# Altium schematic sheet Sheet2.SchDoc
size A3; Organization: Altium Limited; Address1: L3, 12a Rodborough Rd; Address2: Frenchs Forest; Address3: NSW; Address4: Australia 2086
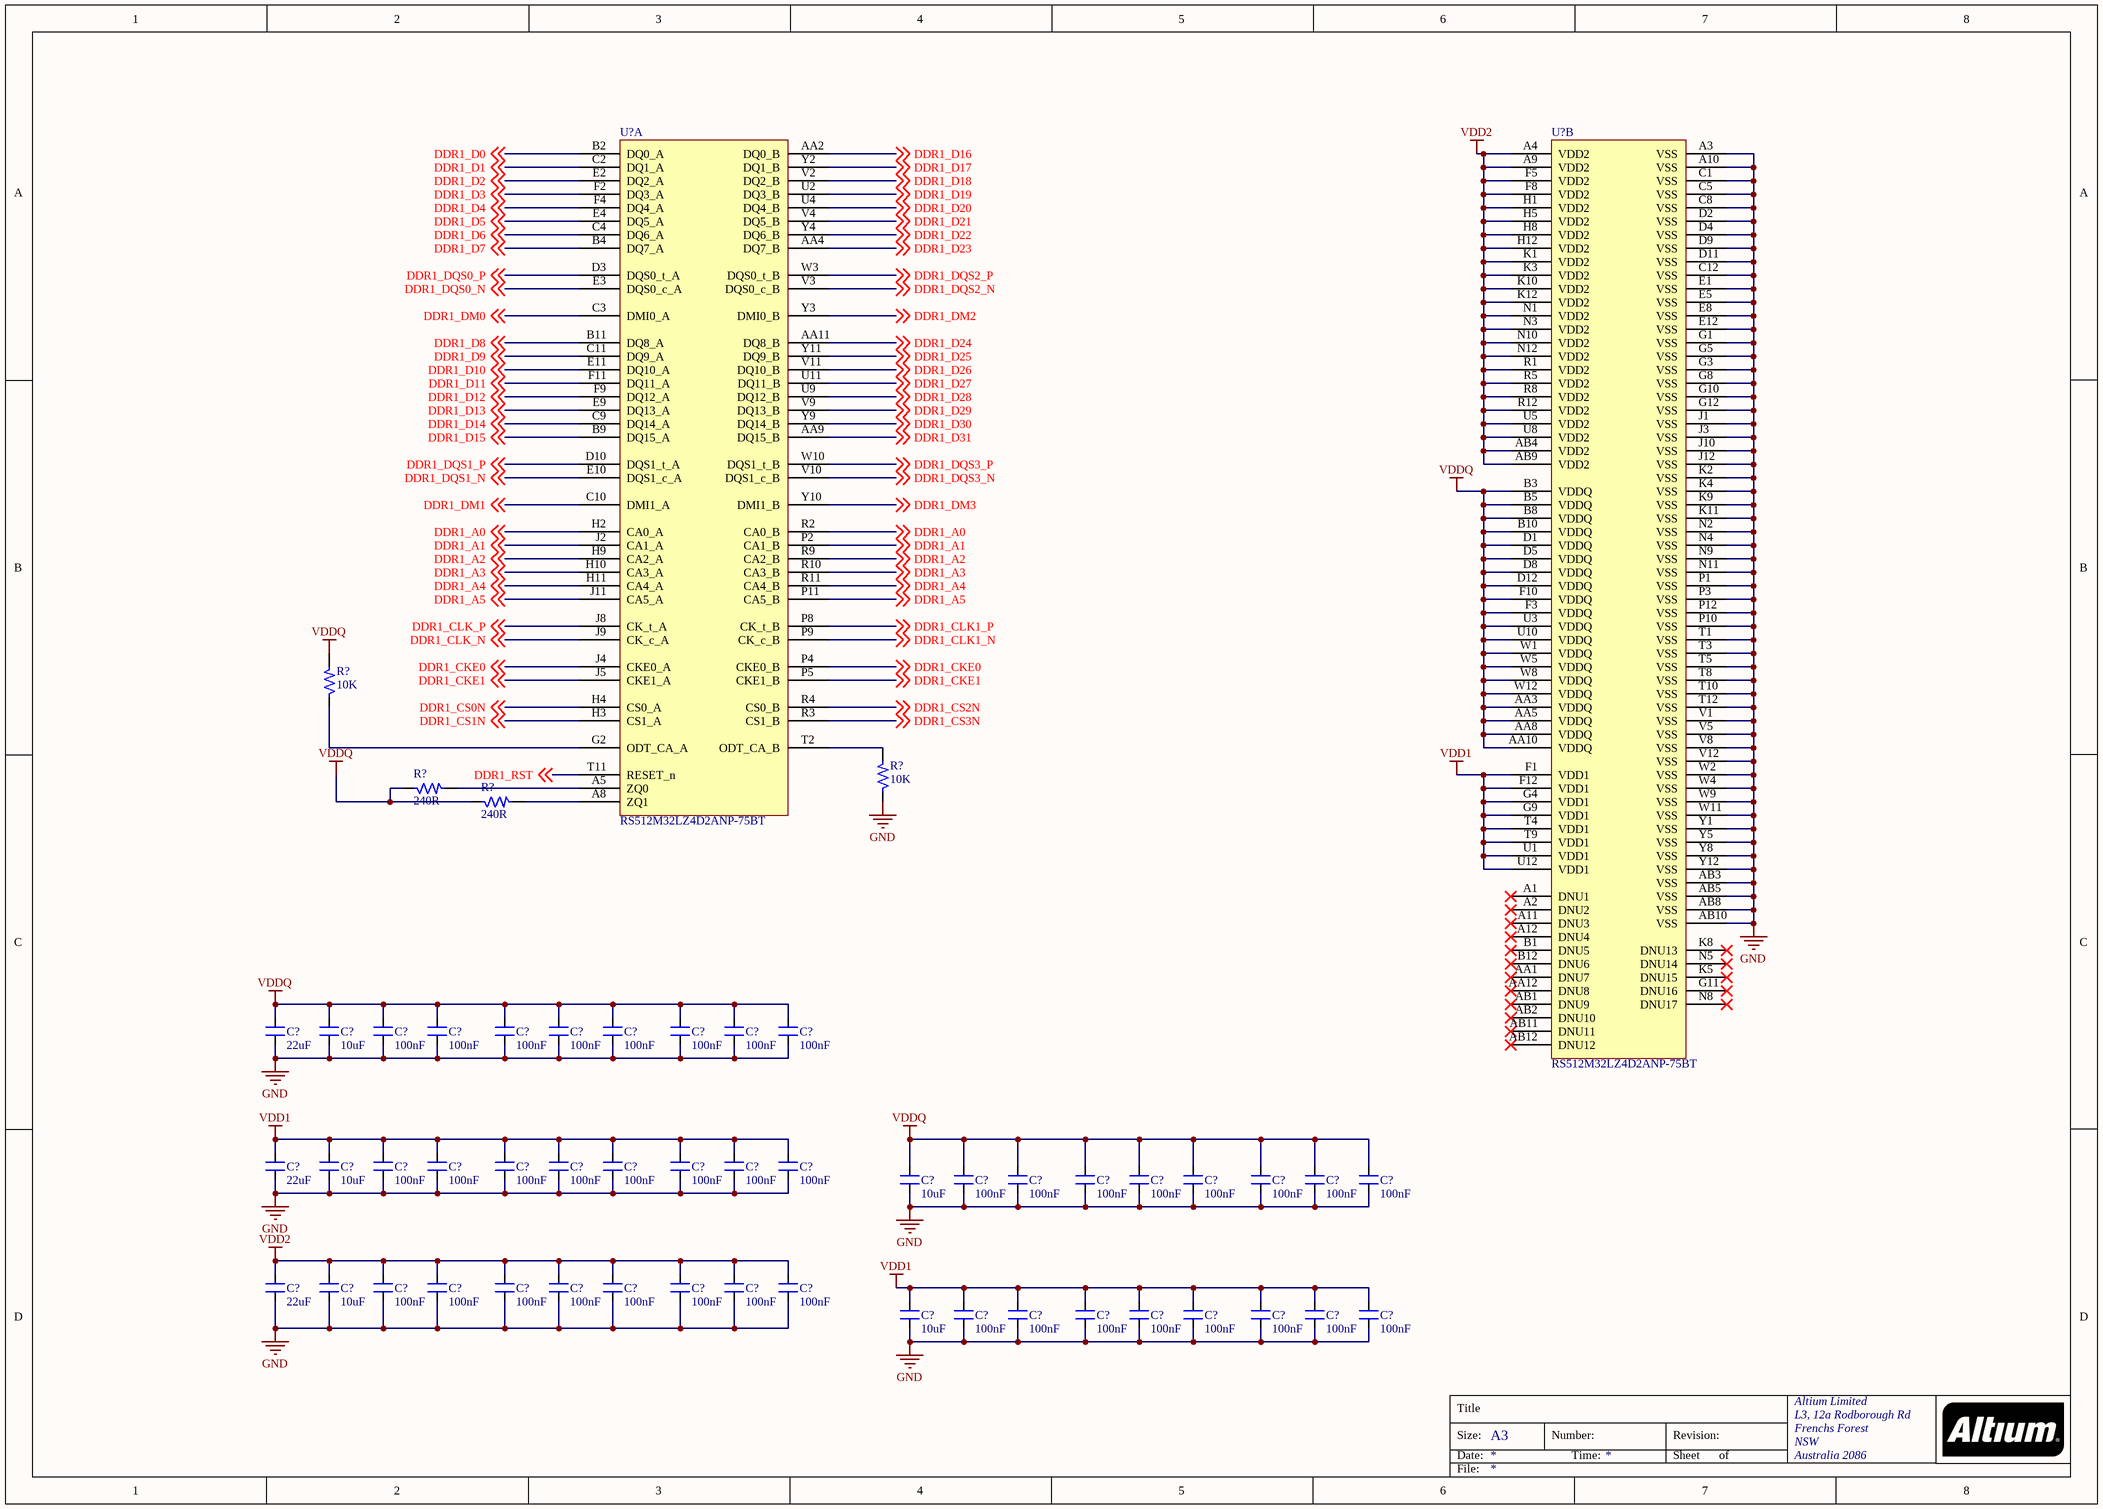
[diagram p0: Sheet2.SchDoc]

## Parts
(Parts that share a designator on the sheet are numbered #1, #2 ... from top to bottom, then left to right.)
C?#1  22uF  [CAP_0603]
C?#2  10uF  [CAP_0603]
C?#3  100nF  [CAP_0201]
C?#4  100nF  [CAP_0201]
C?#5  100nF  [CAP_0201]
C?#6  100nF  [CAP_0201]
C?#7  100nF  [CAP_0201]
C?#8  100nF  [CAP_0201]
C?#9  100nF  [CAP_0201]
C?#10  100nF  [CAP_0201]
C?#11  22uF  [CAP_0603]
C?#12  10uF  [CAP_0603]
C?#13  100nF  [CAP_0201]
C?#14  100nF  [CAP_0201]
C?#15  100nF  [CAP_0201]
C?#16  100nF  [CAP_0201]
C?#17  100nF  [CAP_0201]
C?#18  100nF  [CAP_0201]
C?#19  100nF  [CAP_0201]
C?#20  100nF  [CAP_0201]
C?#21  10uF  [CAP_0603]
C?#22  100nF  [CAP_0201]
C?#23  100nF  [CAP_0201]
C?#24  100nF  [CAP_0201]
C?#25  100nF  [CAP_0201]
C?#26  100nF  [CAP_0201]
C?#27  100nF  [CAP_0201]
C?#28  100nF  [CAP_0201]
C?#29  100nF  [CAP_0201]
C?#30  22uF  [CAP_0603]
C?#31  10uF  [CAP_0603]
C?#32  100nF  [CAP_0201]
C?#33  100nF  [CAP_0201]
C?#34  100nF  [CAP_0201]
C?#35  100nF  [CAP_0201]
C?#36  100nF  [CAP_0201]
C?#37  100nF  [CAP_0201]
C?#38  100nF  [CAP_0201]
C?#39  100nF  [CAP_0201]
C?#40  10uF  [CAP_0603]
C?#41  100nF  [CAP_0201]
C?#42  100nF  [CAP_0201]
C?#43  100nF  [CAP_0201]
C?#44  100nF  [CAP_0201]
C?#45  100nF  [CAP_0201]
C?#46  100nF  [CAP_0201]
C?#47  100nF  [CAP_0201]
C?#48  100nF  [CAP_0201]
R?#1  10K  [RES_0201]
R?#2  240R  [RES_0201]
R?#3  240R  [RES_0201]
R?#4  10K  [RES_0201]
U?#1  RS512M32LZ4D2ANP-75BT  [FBGA200_SMD]  (part A of 2)
U?#2  RS512M32LZ4D2ANP-75BT  [FBGA200_SMD]  (part B of 2)

## Nets
GND: C?#1.1 C?#2.1 C?#3.1 C?#4.1 C?#5.1 C?#6.1 C?#7.1 C?#8.1 C?#9.1 C?#10.1 C?#11.1 C?#12.1 C?#13.1 C?#14.1 C?#15.1 C?#16.1 C?#17.1 C?#18.1 C?#19.1 C?#20.1 C?#21.1 C?#22.1 C?#23.1 C?#24.1 C?#25.1 C?#26.1 C?#27.1 C?#28.1 C?#29.1 C?#30.1 C?#31.1 C?#32.1 C?#33.1 C?#34.1 C?#35.1 C?#36.1 C?#37.1 C?#38.1 C?#39.1 C?#40.1 C?#41.1 C?#42.1 C?#43.1 C?#44.1 C?#45.1 C?#46.1 C?#47.1 C?#48.1 R?#4.1 U?#2.A3(VSS) U?#2.A10(VSS) U?#2.AB3(VSS) U?#2.AB5(VSS) U?#2.AB8(VSS) U?#2.AB10(VSS) U?#2.C1(VSS) U?#2.C5(VSS) U?#2.C8(VSS) U?#2.C12(VSS) U?#2.D2(VSS) U?#2.D4(VSS) U?#2.D9(VSS) U?#2.D11(VSS) U?#2.E1(VSS) U?#2.E5(VSS) U?#2.E8(VSS) U?#2.E12(VSS) U?#2.G1(VSS) U?#2.G3(VSS) U?#2.G5(VSS) U?#2.G8(VSS) U?#2.G10(VSS) U?#2.G12(VSS) U?#2.J1(VSS) U?#2.J3(VSS) U?#2.J10(VSS) U?#2.J12(VSS) U?#2.K2(VSS) U?#2.K4(VSS) U?#2.K9(VSS) U?#2.K11(VSS) U?#2.N2(VSS) U?#2.N4(VSS) U?#2.N9(VSS) U?#2.N11(VSS) U?#2.P1(VSS) U?#2.P3(VSS) U?#2.P10(VSS) U?#2.P12(VSS) U?#2.T1(VSS) U?#2.T3(VSS) U?#2.T5(VSS) U?#2.T8(VSS) U?#2.T10(VSS) U?#2.T12(VSS) U?#2.V1(VSS) U?#2.V5(VSS) U?#2.V8(VSS) U?#2.V12(VSS) U?#2.W2(VSS) U?#2.W4(VSS) U?#2.W9(VSS) U?#2.W11(VSS) U?#2.Y1(VSS) U?#2.Y5(VSS) U?#2.Y8(VSS) U?#2.Y12(VSS)
VDD1: C?#11.2 C?#12.2 C?#13.2 C?#14.2 C?#15.2 C?#16.2 C?#17.2 C?#18.2 C?#19.2 C?#20.2 C?#40.2 C?#41.2 C?#42.2 C?#43.2 C?#44.2 C?#45.2 C?#46.2 C?#47.2 C?#48.2 U?#2.F1(VDD1) U?#2.F12(VDD1) U?#2.G4(VDD1) U?#2.G9(VDD1) U?#2.T4(VDD1) U?#2.T9(VDD1) U?#2.U1(VDD1) U?#2.U12(VDD1)
VDD2: C?#30.2 C?#31.2 C?#32.2 C?#33.2 C?#34.2 C?#35.2 C?#36.2 C?#37.2 C?#38.2 C?#39.2 U?#2.A4(VDD2) U?#2.A9(VDD2) U?#2.AB4(VDD2) U?#2.AB9(VDD2) U?#2.F5(VDD2) U?#2.F8(VDD2) U?#2.H1(VDD2) U?#2.H5(VDD2) U?#2.H8(VDD2) U?#2.H12(VDD2) U?#2.K1(VDD2) U?#2.K3(VDD2) U?#2.K10(VDD2) U?#2.K12(VDD2) U?#2.N1(VDD2) U?#2.N3(VDD2) U?#2.N10(VDD2) U?#2.N12(VDD2) U?#2.R1(VDD2) U?#2.R5(VDD2) U?#2.R8(VDD2) U?#2.R12(VDD2) U?#2.U5(VDD2) U?#2.U8(VDD2)
VDDQ: C?#1.2 C?#2.2 C?#3.2 C?#4.2 C?#5.2 C?#6.2 C?#7.2 C?#8.2 C?#9.2 C?#10.2 C?#21.2 C?#22.2 C?#23.2 C?#24.2 C?#25.2 C?#26.2 C?#27.2 C?#28.2 C?#29.2 R?#1.2 R?#2.1 R?#3.1 U?#2.AA3(VDDQ) U?#2.AA5(VDDQ) U?#2.AA8(VDDQ) U?#2.AA10(VDDQ) U?#2.B3(VDDQ) U?#2.B5(VDDQ) U?#2.B8(VDDQ) U?#2.B10(VDDQ) U?#2.D1(VDDQ) U?#2.D5(VDDQ) U?#2.D8(VDDQ) U?#2.D12(VDDQ) U?#2.F3(VDDQ) U?#2.F10(VDDQ) U?#2.U3(VDDQ) U?#2.U10(VDDQ) U?#2.W1(VDDQ) U?#2.W5(VDDQ) U?#2.W8(VDDQ) U?#2.W12(VDDQ)
DDR1_A0: U?#1.H2(CA0_A) U?#1.R2(CA0_B) ; off-sheet DDR1_A0
DDR1_A1: U?#1.J2(CA1_A) U?#1.P2(CA1_B) ; off-sheet DDR1_A1
DDR1_A2: U?#1.H9(CA2_A) U?#1.R9(CA2_B) ; off-sheet DDR1_A2
DDR1_A3: U?#1.H10(CA3_A) U?#1.R10(CA3_B) ; off-sheet DDR1_A3
DDR1_A4: U?#1.H11(CA4_A) U?#1.R11(CA4_B) ; off-sheet DDR1_A4
DDR1_A5: U?#1.J11(CA5_A) U?#1.P11(CA5_B) ; off-sheet DDR1_A5
DDR1_CKE0: U?#1.J4(CKE0_A) U?#1.P4(CKE0_B) ; off-sheet DDR1_CKE0
DDR1_CKE1: U?#1.J5(CKE1_A) U?#1.P5(CKE1_B) ; off-sheet DDR1_CKE1
DDR1_CLK1_N: U?#1.P9(CK_c_B) ; off-sheet DDR1_CLK1_N
DDR1_CLK1_P: U?#1.P8(CK_t_B) ; off-sheet DDR1_CLK1_P
DDR1_CLK_N: U?#1.J9(CK_c_A) ; off-sheet DDR1_CLK_N
DDR1_CLK_P: U?#1.J8(CK_t_A) ; off-sheet DDR1_CLK_P
DDR1_CS0N: U?#1.H4(CS0_A) ; off-sheet DDR1_CS0N
DDR1_CS1N: U?#1.H3(CS1_A) ; off-sheet DDR1_CS1N
DDR1_CS2N: U?#1.R4(CS0_B) ; off-sheet DDR1_CS2N
DDR1_CS3N: U?#1.R3(CS1_B) ; off-sheet DDR1_CS3N
DDR1_D0: U?#1.B2(DQ0_A) ; off-sheet DDR1_D0
DDR1_D1: U?#1.C2(DQ1_A) ; off-sheet DDR1_D1
DDR1_D2: U?#1.E2(DQ2_A) ; off-sheet DDR1_D2
DDR1_D3: U?#1.F2(DQ3_A) ; off-sheet DDR1_D3
DDR1_D4: U?#1.F4(DQ4_A) ; off-sheet DDR1_D4
DDR1_D5: U?#1.E4(DQ5_A) ; off-sheet DDR1_D5
DDR1_D6: U?#1.C4(DQ6_A) ; off-sheet DDR1_D6
DDR1_D7: U?#1.B4(DQ7_A) ; off-sheet DDR1_D7
DDR1_D8: U?#1.B11(DQ8_A) ; off-sheet DDR1_D8
DDR1_D9: U?#1.C11(DQ9_A) ; off-sheet DDR1_D9
DDR1_D10: U?#1.E11(DQ10_A) ; off-sheet DDR1_D10
DDR1_D11: U?#1.F11(DQ11_A) ; off-sheet DDR1_D11
DDR1_D12: U?#1.F9(DQ12_A) ; off-sheet DDR1_D12
DDR1_D13: U?#1.E9(DQ13_A) ; off-sheet DDR1_D13
DDR1_D14: U?#1.C9(DQ14_A) ; off-sheet DDR1_D14
DDR1_D15: U?#1.B9(DQ15_A) ; off-sheet DDR1_D15
DDR1_D16: U?#1.AA2(DQ0_B) ; off-sheet DDR1_D16
DDR1_D17: U?#1.Y2(DQ1_B) ; off-sheet DDR1_D17
DDR1_D18: U?#1.V2(DQ2_B) ; off-sheet DDR1_D18
DDR1_D19: U?#1.U2(DQ3_B) ; off-sheet DDR1_D19
DDR1_D20: U?#1.U4(DQ4_B) ; off-sheet DDR1_D20
DDR1_D21: U?#1.V4(DQ5_B) ; off-sheet DDR1_D21
DDR1_D22: U?#1.Y4(DQ6_B) ; off-sheet DDR1_D22
DDR1_D23: U?#1.AA4(DQ7_B) ; off-sheet DDR1_D23
DDR1_D24: U?#1.AA11(DQ8_B) ; off-sheet DDR1_D24
DDR1_D25: U?#1.Y11(DQ9_B) ; off-sheet DDR1_D25
DDR1_D26: U?#1.V11(DQ10_B) ; off-sheet DDR1_D26
DDR1_D27: U?#1.U11(DQ11_B) ; off-sheet DDR1_D27
DDR1_D28: U?#1.U9(DQ12_B) ; off-sheet DDR1_D28
DDR1_D29: U?#1.V9(DQ13_B) ; off-sheet DDR1_D29
DDR1_D30: U?#1.Y9(DQ14_B) ; off-sheet DDR1_D30
DDR1_D31: U?#1.AA9(DQ15_B) ; off-sheet DDR1_D31
DDR1_DM0: U?#1.C3(DMI0_A) ; off-sheet DDR1_DM0
DDR1_DM1: U?#1.C10(DMI1_A) ; off-sheet DDR1_DM1
DDR1_DM2: U?#1.Y3(DMI0_B) ; off-sheet DDR1_DM2
DDR1_DM3: U?#1.Y10(DMI1_B) ; off-sheet DDR1_DM3
DDR1_DQS0_N: U?#1.E3(DQS0_c_A) ; off-sheet DDR1_DQS0_N
DDR1_DQS0_P: U?#1.D3(DQS0_t_A) ; off-sheet DDR1_DQS0_P
DDR1_DQS1_N: U?#1.E10(DQS1_c_A) ; off-sheet DDR1_DQS1_N
DDR1_DQS1_P: U?#1.D10(DQS1_t_A) ; off-sheet DDR1_DQS1_P
DDR1_DQS2_N: U?#1.V3(DQS0_c_B) ; off-sheet DDR1_DQS2_N
DDR1_DQS2_P: U?#1.W3(DQS0_t_B) ; off-sheet DDR1_DQS2_P
DDR1_DQS3_N: U?#1.V10(DQS1_c_B) ; off-sheet DDR1_DQS3_N
DDR1_DQS3_P: U?#1.W10(DQS1_t_B) ; off-sheet DDR1_DQS3_P
DDR1_RST: U?#1.T11(RESET_n) ; off-sheet DDR1_RST
NetR?#1_1: R?#1.1 U?#1.G2(ODT_CA_A)
NetR?#2_2: R?#2.2 U?#1.A5(ZQ0)
NetR?#3_2: R?#3.2 U?#1.A8(ZQ1)
NetR?#4_2: R?#4.2 U?#1.T2(ODT_CA_B)

Not connected (* = marked no-connect by the designer): U?#2 A1(DNU1)* A2(DNU2)* A11(DNU3)* A12(DNU4)* AA1(DNU7)* AA12(DNU8)* AB1(DNU9)* AB2(DNU10)* AB11(DNU11)* AB12(DNU12)* B1(DNU5)* B12(DNU6)* G11(DNU16)* K5(DNU15)* K8(DNU13)* N5(DNU14)* N8(DNU17)*

## Notes on the sheet
- Title
- Size:
- Date:
- A3
- Number:
- Time:
- Revision:
- Sheet
- of
- File:

## Library data of the parts
C?#1 C?#11 C?#30 = CAP_22uF-10V-20%-0603: 22µF ±20% 10V Ceramic Capacitor X5R 0603 (1608 Metric) /; Manufacturer: Murata Electronics; Manufacturer Part Number: GRM188R61A226ME15D; Case/Package: 0603; Supplier-1: Digikey
C?#2 C?#12 C?#21 C?#31 C?#40 = CAP_10uF-10V-10%-0603: 10µF ±10% 10V Ceramic Capacitor X5R 0603 (1608 Metric) /; Manufacturer Part Number: GRM188R61A106KE69J; Manufacturer: Murata Electronics; Case/Package: 0603; Supplier-1: Digikey
C?#3-C?#10 C?#13-C?#20 C?#22-C?#29 C?#32-C?#39 C?#41-C?#48 = CAP_100nF-25V-10%-0201: 0.1µF ±10% 25V Ceramic Capacitor X5R 0201 (0603 Metric) /; Manufacturer: TDK Corporation; Manufacturer Part Number: C0603X5R1E104K030BB; Case/Package: 0201; Supplier-1: Digikey
R?#1 R?#4 = RES_10K-0.05W-1%-0201: 10 kOhms ±1% 0.05W, 1/20W Chip Resistor 0201 (0603 Metric) Thick Film /; Manufacturer: Stackpole Electronics Inc; Manufacturer Part Number: RMCF0201FT10K0; Case/Package: 0201; Supplier-1: Digikey
R?#2 R?#3 = RES_240R-0.05W-1%-0201: 240 Ohms ±1% 0.05W, 1/20W Chip Resistor 0201 (0603 Metric) Thick Film /; Manufacturer: Yageo; Manufacturer Part Number: RC0201FR-07240RL; Case/Package: 0201; Supplier-1: Digikey
U?#1 U?#2 = IC_RS512M32LZ4D2ANP-75BT: LPDDR4/4X Package FBGA 200b Density 4Gbit~64Gbit Operating Temperature Range：-25~85℃ Speed：2667Mbps/3200Mbps/3733Mbps Voltage：VDD1/VDD2/VDDQ= 1.8 / 1.1 / 1.1 V（LPDDR4）VDD1/VDD2/VDDQ = 1.8 / 1.1 / 0.6 V（LPDDR4X）Approved Verification Platform：MTK、Spreadtrum; Manufacturer: RAYSON; Manufacturer Part Number: RS512M32LZ4D2ANP-75BT; Case/Package: FBGA 200b; Supplier-1: RAYSON